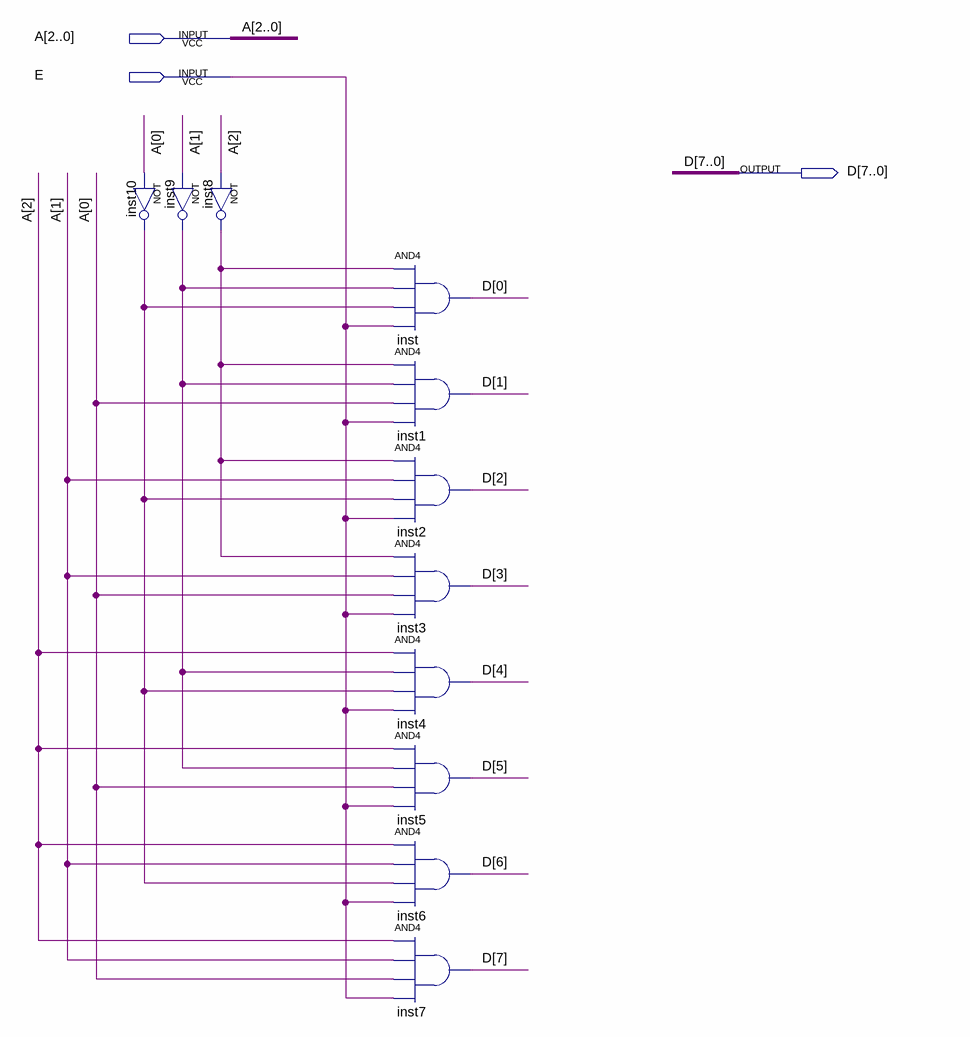
[diagram p0: schematic sheet]
// Quartus schematic 3to8decoder.bdf as structural Verilog: 11 symbols, 3 pins
module \3to8decoder  (
  input  [2:0] A,
  input  E,
  output [7:0] D
);

  wire inst8_out, inst9_out, inst10_out;

  not inst9 (inst9_out, A[1]);
  not inst10 (inst10_out, A[0]);
  not inst8 (inst8_out, A[2]);
  and inst (D[0], inst8_out, inst9_out, inst10_out, E);
  and inst1 (D[1], inst8_out, inst9_out, A[0], E);
  and inst2 (D[2], inst8_out, A[1], inst10_out, E);
  and inst3 (D[3], inst8_out, A[1], A[0], E);
  and inst4 (D[4], A[2], inst9_out, inst10_out, E);
  and inst5 (D[5], A[2], inst9_out, A[0], E);
  and inst6 (D[6], A[2], A[1], inst10_out, E);
  and inst7 (D[7], A[2], A[1], A[0], E);
endmodule
